# EAGLE design eTapper1main39 (EAGLE 8.4.1)
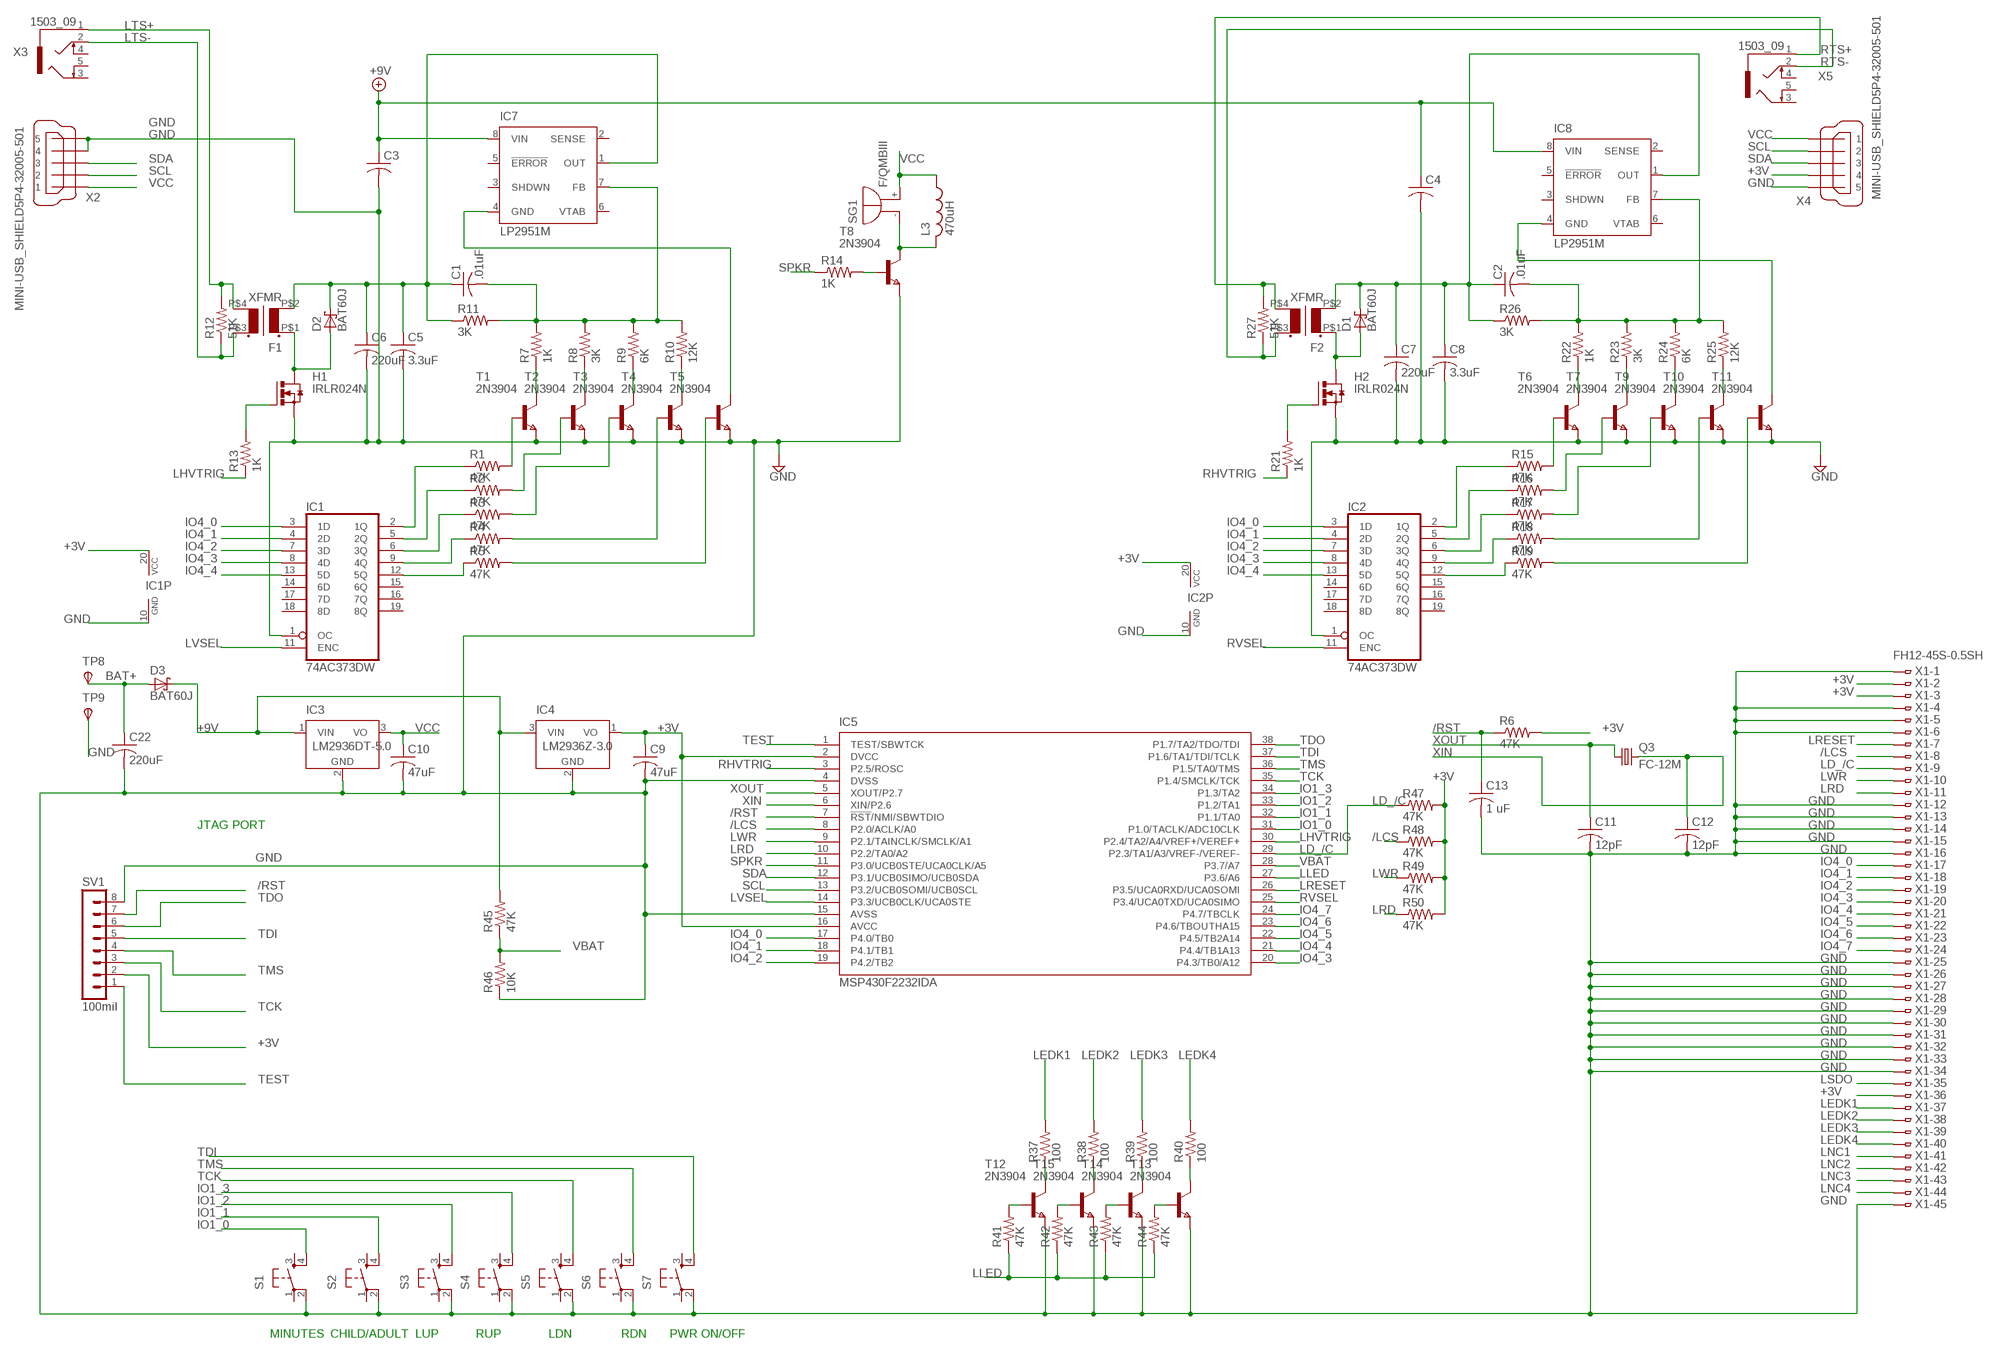
[diagram p0: schematic, sheet 1]

## Parts
C1  .01uF  C-USC0805  [C0805]
C2  .01uF  C-USC0805  [C0805]
C3  C-USC1206  [C1206]
C4  C-USC1206  [C1206]
C5  3.3uF  C-USC0805  [C0805]
C6  220uF  C-USC1206  [C1206]
C7  220uF  C-USC1206  [C1206]
C8  3.3uF  C-USC0805  [C0805]
C9  47uF  C-USC1206  [C1206]
C10  47uF  C-USC1206  [C1206]
C11  12pF  C-USC0805  [C0805]
C12  12pF  C-USC0805  [C0805]
C13  1 uF  C-USC0805  [C0805]
C22  220uF  C-USC1206  [C1206]
D1  BAT60J  [SOD323_ST]
D2  BAT60J  [SOD323_ST]
D3  BAT60J  [SOD323_ST]
F1  XFMR  [XFMR]
F2  XFMR  [XFMR]
H1  IRLR024N  [D-PAK_TO252AA]
H2  IRLR024N  [D-PAK_TO252AA]
IC1  74AC373DW  [SO20W]
IC2  74AC373DW  [SO20W]
IC3  LM2936DT-5.0  [TO252]
IC4  LM2936Z-3.0  [TO92]
IC5  MSP430F2232IDA  [TSSOP38_R-PDSO-G38-DA]
IC7  LP2951M  [SO08]
IC8  LP2951M  [SO08]
L3  470uH  L-USL2825P  [L2825P]
Q3  FC-12M  [FC-12M]
R1  47K  R-US_R0402  [R0402]
R2  47K  R-US_R0402  [R0402]
R3  47K  R-US_R0402  [R0402]
R4  47K  R-US_R0402  [R0402]
R5  47K  R-US_R0402  [R0402]
R6  47K  R-US_R0402  [R0402]
R7  1K  R-US_R0402  [R0402]
R8  3K  R-US_R0402  [R0402]
R9  6K  R-US_R0402  [R0402]
R10  12K  R-US_R0402  [R0402]
R11  3K  R-US_R0402  [R0402]
R12  51K  R-US_R0402  [R0402]
R13  1K  R-US_R0402  [R0402]
R14  1K  R-US_R0402  [R0402]
R15  47K  R-US_R0402  [R0402]
R16  47K  R-US_R0402  [R0402]
R17  47K  R-US_R0402  [R0402]
R18  47K  R-US_R0402  [R0402]
R19  47K  R-US_R0402  [R0402]
R21  1K  R-US_R0402  [R0402]
R22  1K  R-US_R0402  [R0402]
R23  3K  R-US_R0402  [R0402]
R24  6K  R-US_R0402  [R0402]
R25  12K  R-US_R0402  [R0402]
R26  3K  R-US_R0402  [R0402]
R27  51K  R-US_R0402  [R0402]
R37  100  R-US_R0402  [R0402]
R38  100  R-US_R0402  [R0402]
R39  100  R-US_R0402  [R0402]
R40  100  R-US_R0402  [R0402]
R41  47K  R-US_R0402  [R0402]
R42  47K  R-US_R0402  [R0402]
R43  47K  R-US_R0402  [R0402]
R44  47K  R-US_R0402  [R0402]
R45  47K  R-US_R0402  [R0402]
R46  10K  R-US_R0402  [R0402]
R47  47K  R-US_R0402  [R0402]
R48  47K  R-US_R0402  [R0402]
R49  47K  R-US_R0402  [R0402]
R50  47K  R-US_R0402  [R0402]
S1  10-XX  [B3F-10XX]
S2  10-XX  [B3F-10XX]
S3  10-XX  [B3F-10XX]
S4  10-XX  [B3F-10XX]
S5  10-XX  [B3F-10XX]
S6  10-XX  [B3F-10XX]
S7  10-XX  [B3F-10XX]
SG1  F/QMBIII  [F/QMBIII]
SV1  100mil  MA08-1  [MA08-1]
T1  2N3904  NPNSOT23  [SOT-23]
T2  2N3904  NPNSOT23  [SOT-23]
T3  2N3904  NPNSOT23  [SOT-23]
T4  2N3904  NPNSOT23  [SOT-23]
T5  2N3904  NPNSOT23  [SOT-23]
T6  2N3904  NPNSOT23  [SOT-23]
T7  2N3904  NPNSOT23  [SOT-23]
T8  2N3904  NPNSOT23  [SOT-23]
T9  2N3904  NPNSOT23  [SOT-23]
T10  2N3904  NPNSOT23  [SOT-23]
T11  2N3904  NPNSOT23  [SOT-23]
T12  2N3904  NPNSOT23  [SOT-23]
T13  2N3904  NPNSOT23  [SOT-23]
T14  2N3904  NPNSOT23  [SOT-23]
T15  2N3904  NPNSOT23  [SOT-23]
TP8  TPSPAD1-13  [P1-13]
TP9  TPSPAD1-13  [P1-13]
X1  FH12-45S-0.5SH  [FH12-45S-0.5SH]
X2  MINI-USB_SHIELD5P4-32005-501  [32005-501]
X3  1503_09  [1503_09]
X4  MINI-USB_SHIELD5P4-32005-501  [32005-501]
X5  1503_09  [1503_09]

## Nets
+3V [+3V]: C9.1 IC1.20(VCC) IC2.20(VCC) IC4.1(VO) IC5.2(DVCC) IC5.16(AVCC) R6.2 R47.2 R48.2 R49.2 R50.2 SV1.2 X1.2 X1.3 X1.36 X4.4
+9V [+9V]: C3.1 C4.1 D3.C IC3.1(VIN) IC4.3(VIN) IC7.8(VIN) IC8.8(VIN) R45.2
/LCS: IC5.8(P2.0/ACLK/A0) R48.1 X1.8
/RST: C13.1 IC5.7(!RST!/NMI/SBWTDIO) R6.1 SV1.7
BAT+ [BAT+]: C22.1 D3.A TP8.TP(PP)
GND [GND]: C3.2 C4.2 C5.2 C6.2 C7.2 C8.2 C9.2 C10.2 C11.2 C12.2 C13.2 C22.2 H1.3(S) H2.3(S) IC1.1(OC) IC1.10(GND) IC2.1(OC) IC2.10(GND) IC3.2(GND) IC4.2(GND) IC5.4(DVSS) IC5.15(AVSS) R46.1 S1.2(P1) S2.2(P1) S3.2(P1) S4.2(P1) S5.2(P1) S6.2(P1) S7.2(P1) SV1.8 T1.2(E) T2.2(E) T3.2(E) T4.2(E) T5.2(E) T6.2(E) T7.2(E) T8.2(E) T9.2(E) T10.2(E) T11.2(E) T12.2(E) T13.2(E) T14.2(E) T15.2(E) TP9.TP(PP) X1.1 X1.4 X1.5 X1.6 X1.12 X1.13 X1.14 X1.15 X1.16 X1.25 X1.26 X1.27 X1.28 X1.29 X1.30 X1.31 X1.32 X1.33 X1.34 X1.45 X2.4 X2.5 X4.5
IO1_0: IC5.31(P1.0/TACLK/ADC10CLK) S1.4(S1)
IO1_1: IC5.32(P1.1/TA0) S2.4(S1)
IO1_2: IC5.33(P1.2/TA1) S3.4(S1)
IO1_3: IC5.34(P1.3/TA2) S4.4(S1)
IO4_0: IC1.3(1D) IC2.3(1D) IC5.17(P4.0/TB0) X1.17
IO4_1: IC1.4(2D) IC2.4(2D) IC5.18(P4.1/TB1) X1.18
IO4_2: IC1.7(3D) IC2.7(3D) IC5.19(P4.2/TB2) X1.19
IO4_3: IC1.8(4D) IC2.8(4D) IC5.20(P4.3/TB0/A12) X1.20
IO4_4: IC1.13(5D) IC2.13(5D) IC5.21(P4.4/TB1A13) X1.21
IO4_5: IC5.22(P4.5/TB2A14) X1.22
IO4_6: IC5.23(P4.6/TBOUTHA15) X1.23
IO4_7: IC5.24(P4.7/TBCLK) X1.24
LD_/C: IC5.29(P2.3/TA1/A3/VREF-/VEREF-) R47.1 X1.9
LEDK1: R37.2 X1.37
LEDK2: R38.2 X1.38
LEDK3: R39.2 X1.39
LEDK4: R40.2 X1.40
LHVTRIG: IC5.30(P2.4/TA2/A4/VREF+/VEREF+) R13.1
LLED: IC5.27(P3.6/A6) R41.1 R42.1 R43.1 R44.1
LNC1: X1.41
LNC2: X1.42
LNC3: X1.43
LNC4: X1.44
LRD: IC5.10(P2.2/TA0/A2) R50.1 X1.11
LRESET: IC5.26(P3.5/UCA0RXD/UCA0SOMI) X1.7
LSDO: X1.35
LTS+: F1.P$4(S2) R12.2 X3.1
LTS-: F1.P$3(S1) R12.1 X3.2
LVSEL: IC1.11(ENC) IC5.14(P3.3/UCB0CLK/UCA0STE)
LWR: IC5.9(P2.1/TAINCLK/SMCLK/A1) R49.1 X1.10
N$1: IC1.2(1Q) R1.1
N$2: IC1.5(2Q) R2.1
N$3: IC1.6(3Q) R3.1
N$4: IC1.9(4Q) R4.1
N$5: IC1.12(5Q) R5.1
N$6: L3.2 SG1.-(+) T8.1(C)
N$7: R4.2 T4.3(B)
N$8: R5.2 T5.3(B)
N$9: D2.A F1.P$1(P1) H1.4(D)
N$10: R7.1 T1.1(C)
N$11: R8.1 T2.1(C)
N$12: R9.1 T3.1(C)
N$13: R1.2 T1.3(B)
N$14: R2.2 T2.3(B)
N$15: R3.2 T3.3(B)
N$16: R10.1 T4.1(C)
N$17: C1.2 IC7.7(FB) R7.2 R8.2 R9.2 R10.2 R11.2
N$18: C1.1 C5.1 C6.1 D2.C F1.P$2(P2) IC7.1(OUT) R11.1
N$19: D1.A F2.P$1(P1) H2.4(D)
N$20: IC2.2(1Q) R15.1
N$21: H1.1(G) R13.2
N$22: R14.2 T8.3(B)
N$24: IC2.5(2Q) R16.1
N$25: IC2.6(3Q) R17.1
N$26: IC2.9(4Q) R18.1
N$27: IC2.12(5Q) R19.1
N$28: R44.2 T13.3(B)
N$29: R15.2 T6.3(B)
N$30: R16.2 T7.3(B)
N$31: R17.2 T9.3(B)
N$32: R18.2 T10.3(B)
N$33: R19.2 T11.3(B)
N$35: R22.1 T6.1(C)
N$36: R23.1 T7.1(C)
N$37: R24.1 T9.1(C)
N$38: R25.1 T10.1(C)
N$39: C2.2 IC8.7(FB) R22.2 R23.2 R24.2 R25.2 R26.2
N$40: C2.1 C7.1 C8.1 D1.C F2.P$2(P2) IC8.1(OUT) R26.1
N$41: R37.1 T12.1(C)
N$42: H2.1(G) R21.2
N$43: R38.1 T15.1(C)
N$44: R39.1 T14.1(C)
N$45: IC7.4(GND) T5.1(C)
N$46: R40.1 T13.1(C)
N$47: IC8.4(GND) T11.1(C)
N$48: R43.2 T14.3(B)
N$49: R41.2 T12.3(B)
N$50: R42.2 T15.3(B)
RHVTRIG: IC5.3(P2.5/ROSC) R21.1
RTS+: F2.P$4(S2) R27.2 X5.1
RTS-: F2.P$3(S1) R27.1 X5.2
RVSEL: IC2.11(ENC) IC5.25(P3.4/UCA0TXD/UCA0SIMO)
SCL: IC5.13(P3.2/UCB0SOMI/UCB0SCL) X2.2 X4.2
SDA: IC5.12(P3.1/UCB0SIMO/UCB0SDA) X2.3 X4.3
SPKR: IC5.11(P3.0/UCB0STE/UCA0CLK/A5) R14.1
TCK: IC5.35(P1.4/SMCLK/TCK) S5.4(S1) SV1.3
TDI: IC5.37(P1.6/TA1/TDI/TCLK) S7.4(S1) SV1.5
TDO: IC5.38(P1.7/TA2/TDO/TDI) SV1.6
TEST: IC5.1(TEST/SBWTCK) SV1.1
TMS: IC5.36(P1.5/TA0/TMS) S6.4(S1) SV1.4
VBAT: IC5.28(P3.7/A7) R45.1 R46.2
VCC [VCC]: C10.1 IC3.3(VO) L3.1 SG1.+(-) X2.1 X4.1
XIN: C12.1 IC5.6(XIN/P2.6) Q3.2
XOUT: C11.1 IC5.5(XOUT/P2.7) Q3.1
Unconnected: IC1.14(6D) IC1.15(6Q) IC1.16(7Q) IC1.17(7D) IC1.18(8D) IC1.19(8Q) IC2.14(6D) IC2.15(6Q) IC2.16(7Q) IC2.17(7D) IC2.18(8D) IC2.19(8Q) IC7.2(SENSE) IC7.3(SHDWN) IC7.5(!ERROR) IC7.6(VTAB) IC8.2(SENSE) IC8.3(SHDWN) IC8.5(!ERROR) IC8.6(VTAB) S1.1(P) S1.3(S) S2.1(P) S2.3(S) S3.1(P) S3.3(S) S4.1(P) S4.3(S) S5.1(P) S5.3(S) S6.1(P) S6.3(S) S7.1(P) S7.3(S) X2.M1(S1) X2.M2(S2) X2.M3(S3) X2.M4(S4) X3.3 X3.4 X3.5 X4.M1(S1) X4.M2(S2) X4.M3(S3) X4.M4(S4) X5.3 X5.4 X5.5

## Notes on the sheet
- JTAG PORT
- MINUTES | CHILD/ADULT | LUP | RUP | LDN | RDN | PWR ON/OFF

## Library data of the parts
C1-C13 C22 = rcl:C-US: CAPACITOR, American symbol
D1-D3 = diode:BAT60J: Schottky barrier diode Source: www.st.com, BAT60J.pdf
F1 F2 = XFMR1:XFMR: Transformer 1"X1" 0.4"X0.4" hole separation for e_tapper
H1 H2 = IRLR024N:IRLR024N: IRLR024N HEXFET Power Mosfet N channel Infeneon Technology TO-251AA IPAK
IC1 IC2 = 74xx-eu:74*373: Octal D type transparent LATCH, edge triggered
IC3 = national-semiconductor:LM2936?*: Ultra-Low Quiescent Current LDO Voltage Regulator Source: Data sheet <http://www.national.com/ds/LM/LM2936.pdf>; MF: NATIONAL SEMICONDUCTOR; MPN: LM2936DT-5.0/NOPB; OC_FARNELL: 1286864; OC_NEWARK: 41K4501
IC4 = national-semiconductor:LM2936?*: Ultra-Low Quiescent Current LDO Voltage Regulator Source: Data sheet <http://www.national.com/ds/LM/LM2936.pdf>; MF: NATIONAL SEMICONDUCTOR; MPN: LM2936Z-3.0/NOPB; OC_FARNELL: 1312709; OC_NEWARK: 41K4531
IC5 = texas:MSP430F22*2IDA: MIXED SIGNAL MICROCONTROLLER Source: http://focus.ti.com/lit/ds/symlink/msp430f2274.pdf; MPN: MSP430F2232IDA; OC_FARNELL: 1610178; OC_NEWARK: 28M6312
IC7 IC8 = national-semiconductor:LP2951: Adjustable Micropower Voltage Regulator Source: http://www.national.com/ds/LP/LP2950.pdf; MF: FAIRCHILD SEMICONDUCTOR; MPN: LP2951CM; OC_FARNELL: 9488561; OC_NEWARK: 78K6014
L3 = rcl:L-US: INDUCTOR, American symbol
Q3 = crystal:FC-12M: kHz RANGE CRYSTAL UNIT LOW PROFILE SMD Source: Epson Toyocom FC-12M.pdf
R1-R19 R21-R27 R37-R50 = resistor:R-US_: RESISTOR, American symbol
S1-S7 = switch-omron:10-XX: OMRON SWITCH; MPN: B3F-1000; OC_FARNELL: 176432; OC_NEWARK: 36M3542
SG1 = buzzer:F/QMBIII: BUZZER Source: Buerklin; OC_FARNELL: unknown; OC_NEWARK: unknown
SV1 = con-lstb:MA08-1: PIN HEADER; OC_FARNELL: unknown; OC_NEWARK: unknown
T1-T15 = zetex:NPNSOT23: NPN TRANSISTOR; MPN: DSS20201L-7; OC_FARNELL: 1710688; OC_NEWARK: 25R4555
TP8 TP9 = testpad:TPS: TEST PIN
X1 = con-hirose:FH12-45S-0.5S: 0.5mm Pitch Connectors For FPC/FFC Source: Data sheet <http://www.hirose.co.jp/cataloge_hp/e58605370.pdf>; OC_FARNELL: unknown; OC_NEWARK: unknown
X2 X4 = con-cypressindustries:MINI-USB_SHIELD5P4-: MINI USB-B R/A W/O POST 5 pol. Source: www.cypressindustries.com; OC_FARNELL: unknown; OC_NEWARK: unknown
X3 X5 = con-lumberg:1503_09: Jack connectors according to JISC 6560, 3.5 mm Klinkeneinbaukupplung nach JISC 6560, 3,5 mm, 3-polig/ stereo, abgewinkelte Ausführung, mit 2 Öffnern und Lötaugen, für Leiterplatten Rückseitenmontage Source: http://www.lumberg.com/Produkte/PDFs/1503_09.pdf; OC_FARNELL: 1243244; OC_NEWARK: unknown

## Module LP2951
Ports: 

### Library data of the parts

## Net classes
1 GND: width 0.305 mm, clearance 0.152 mm
2 BAT+: width 0.305 mm, clearance 0.152 mm
3 +9V: width 0.305 mm, clearance 0.152 mm
4 +3V: width 0.305 mm, clearance 0.152 mm
5 VCC: width 0.305 mm, clearance 0.152 mm

## Board
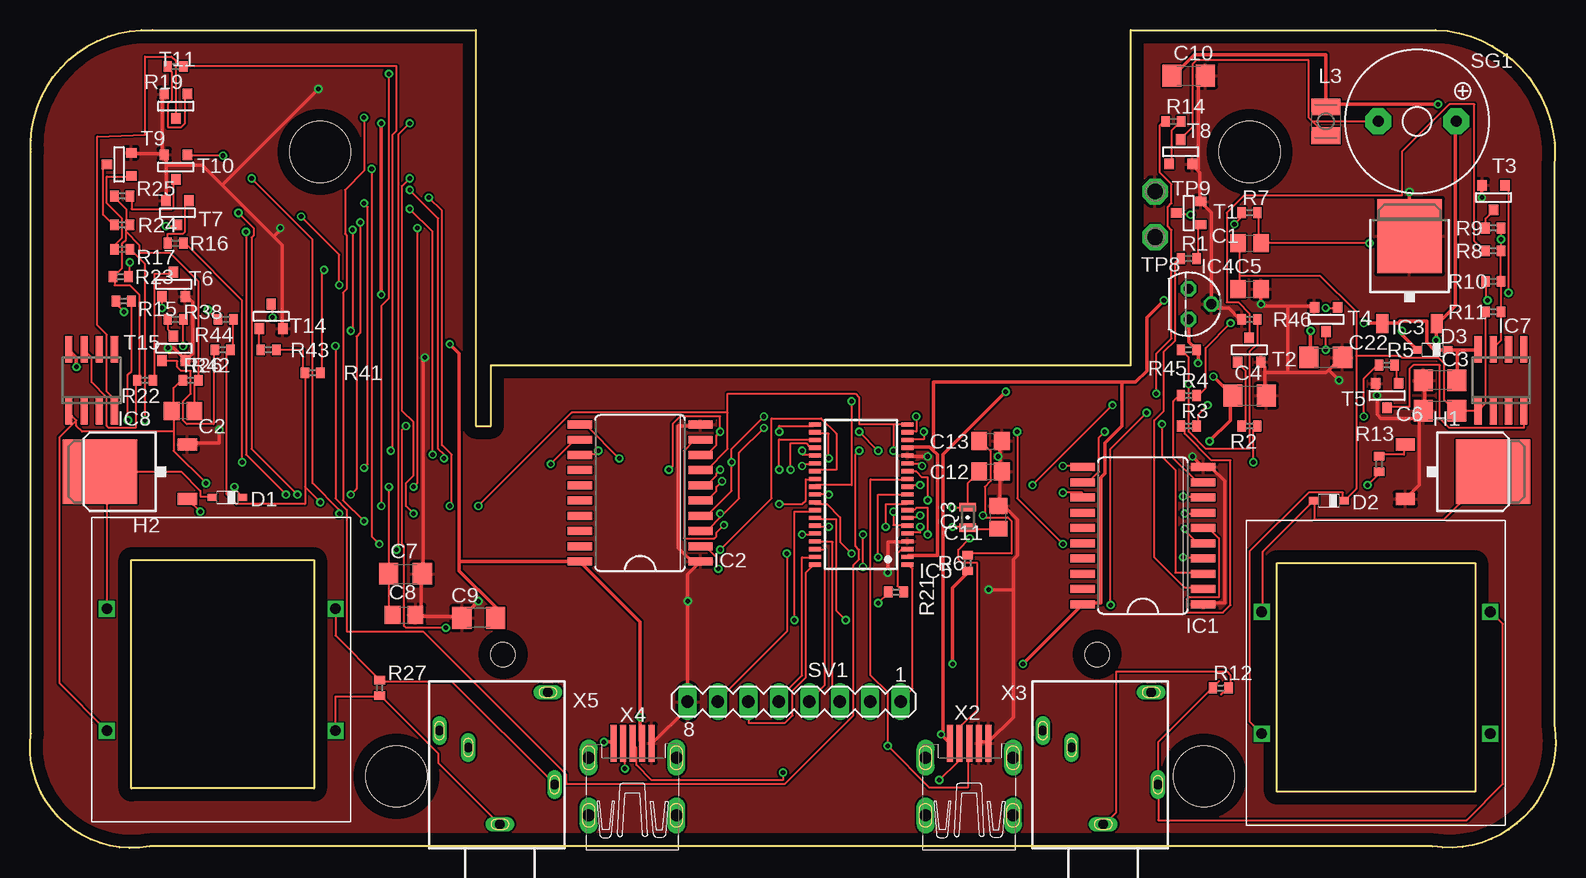
[diagram p1: board, top side]
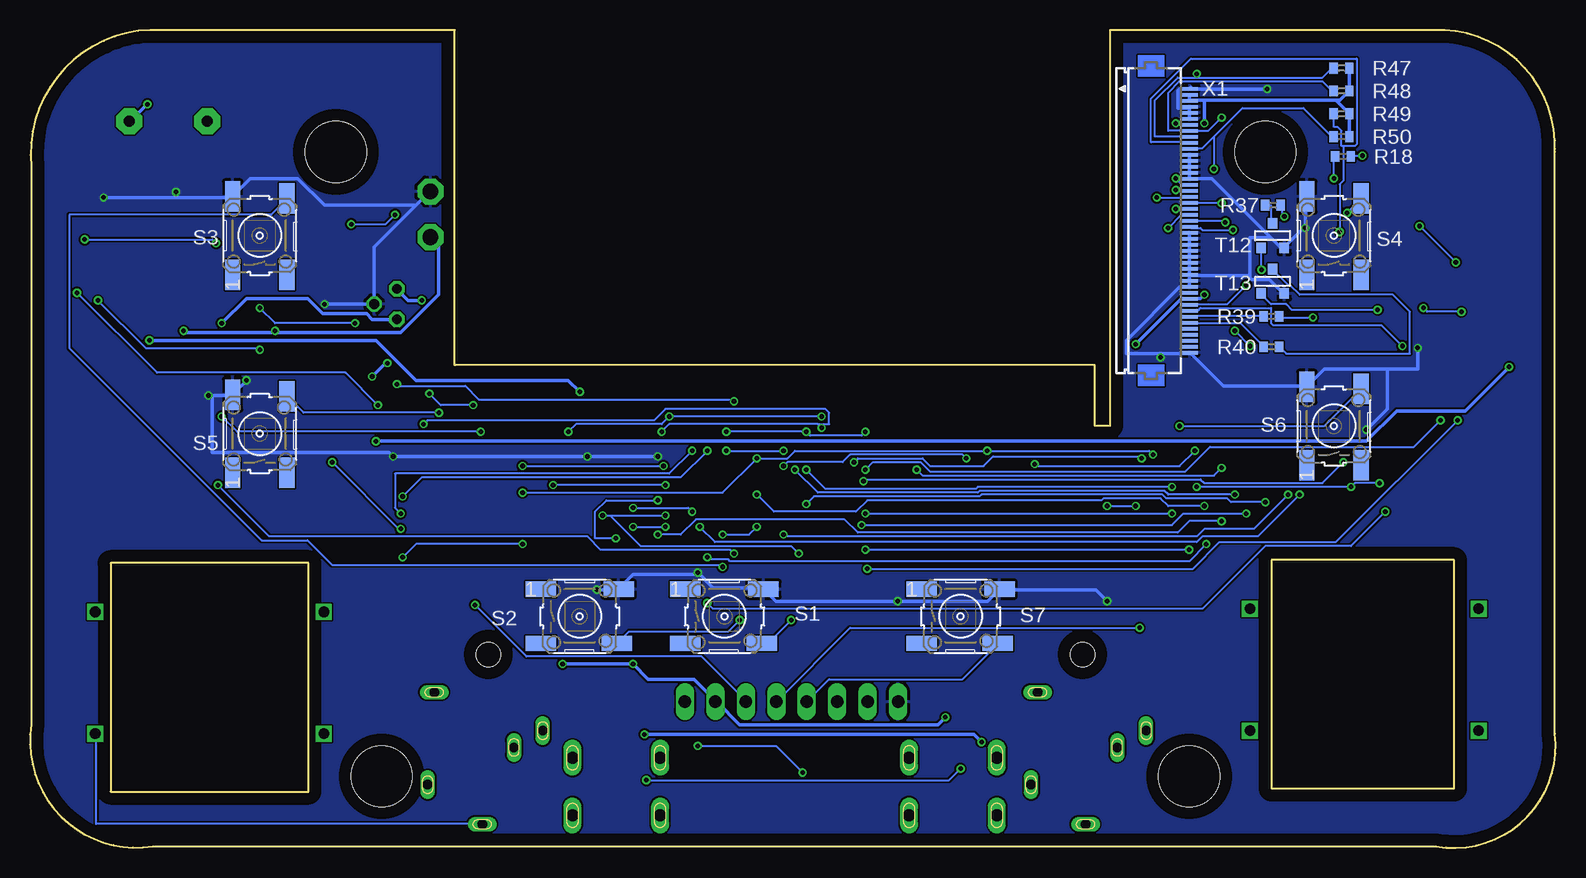
[diagram p2: board, bottom side, seen from below]

Size 127.17 x 68.21 mm. Coordinates in mm from the lower left corner, seen from the top.
Outline: 0.06,58.04 0.06,58.3 0.06,9.53
Outline: 0.06,58.04 0.06,9.53
Outline: 0.06,58.04 arc-96 10.22,68.2 37.15,68.2 37.15,35.18 38.42,35.18 38.42,40.26 91.76,40.26 91.76,68.2 117.16,68.2 arc-94 127.06,56.77 127.06,10.29 arc-108 116.9,0.13 9.97,0.13 arc-107 0.06,9.53
Outline: 103.95,23.75 120.46,23.75 120.46,4.7 103.95,4.7 103.95,23.75
Outline: 8.45,24.01 23.69,24.01 23.69,4.96 8.45,4.96 8.45,24.01
Copper layers (1*16): Top 0.035mm / dielectric 30mil / Bottom 0.035mm
Design rules "default *": minimum track width 6mil, minimum drill 15mil, track to track 6mil, track to pad 6mil, pad to pad 6mil, via to via 6mil, smd to smd 6mil, copper to edge 40mil, drill to drill 6mil, minimum pad ring 6mil, minimum via ring 6mil, stop-mask expansion 4mil, vias tented up to drill 0mil, thermal gap 10mil
Holes 5.08 mm at 24.19,58.04 101.66,58.04 30.54,5.97 97.85,5.97
Holes 2.03 mm at 39.43,16.13 88.96,16.13

### Footprints (pad centres in the part's own frame; a part is rotated, then mirrored left to right if it is on the bottom)
C0805 = smd 1.3 x 1.5: 1 -0.95,0; 2 0.95,0
C1206 = smd 1.6 x 1.8: 1 -1.4,0; 2 1.4,0
SOD323_ST = smd 0.8 x 0.6: A 1.25,0; C -1.25,0
XFMR = drill 0.889 square: P$1 -10.16,5.08; P$2 -10.16,-5.08; P$3 8.89,5.08; P$4 8.89,-5.08
D-PAK_TO252AA = smd 1 x 1.6: 1 -2.28,-4.8; 3 2.28,-4.8 | smd 5.4 x 6.2: 4 0,2.5
SO20W = smd 0.66 x 2.032: 1 -5.715,-5.029; 2 -4.445,-5.029; 3 -3.175,-5.029; 4 -1.905,-5.029; 5 -0.635,-5.029; 6 0.635,-5.029; 7 1.905,-5.029; 8 3.175,-5.029; 9 4.445,-5.029; 10 5.715,-5.029; 11 5.715,5.029; 12 4.445,5.029; 13 3.175,5.029; 14 1.905,5.029; 15 0.635,5.029; 16 -0.635,5.029; 17 -1.905,5.029; 18 -3.175,5.029; 19 -4.445,5.029; 20 -5.715,5.029
TO252 = smd 1 x 1.6: 1 -2.28,-4.8; 3 2.28,-4.8 | smd 5.4 x 6.2: 2 0,2.5
TO92 = drill 0.813 pad 1.27 octagon: 1 -1.27,0; 2 0,1.905; 3 1.27,0
TSSOP38_R-PDSO-G38-DA = smd 0.35 x 1: 1 -5.85,-3.85; 2 -5.2,-3.85; 3 -4.55,-3.85; 4 -3.9,-3.85; 5 -3.25,-3.85; 6 -2.6,-3.85; 7 -1.95,-3.85; 8 -1.3,-3.85; 9 -0.65,-3.85; 10 0,-3.85; 11 0.65,-3.85; 12 1.3,-3.85; 13 1.95,-3.85; 14 2.6,-3.85; 15 3.25,-3.85; 16 3.9,-3.85; 17 4.55,-3.85; 18 5.2,-3.85; 19 5.85,-3.85; 20 5.85,3.85; 21 5.2,3.85; 22 4.55,3.85; 23 3.9,3.85; 24 3.25,3.85; 25 2.6,3.85; 26 1.95,3.85; 27 1.3,3.85; 28 0.65,3.85; 29 0,3.85; 30 -0.65,3.85; 31 -1.3,3.85; 32 -1.95,3.85; 33 -2.6,3.85; 34 -3.25,3.85; 35 -3.9,3.85; 36 -4.55,3.85; 37 -5.2,3.85; 38 -5.85,3.85
SO08 = smd 0.6 x 2.2: 1 -1.905,-2.6; 2 -0.635,-2.6; 3 0.635,-2.6; 4 1.905,-2.6; 5 1.905,2.6; 6 0.635,2.6; 7 -0.635,2.6; 8 -1.905,2.6
L2825P = smd 1.4 x 2.4: 1 -1.2,0; 2 1.2,0
FC-12M = smd 0.7 x 1.4: 1 -0.85,0; 2 0.85,0
R0402 = smd 0.7 x 0.9: 1 -0.65,0; 2 0.65,0
B3F-10XX = smd 2.54 x 1.27: 1 -3.251,2.261; 2 3.251,2.261; 3 -3.251,-2.261; 4 3.099,-2.261
F/QMBIII = drill 0.914 pad 2.159 octagon: + 3.251,0; - -3.251,0
MA08-1 = drill 1.016 long: 1 -8.89,0; 2 -6.35,0; 3 -3.81,0; 4 -1.27,0; 5 1.27,0; 6 3.81,0; 7 6.35,0; 8 8.89,0
SOT-23 = smd 0.787 x 0.889: 1 0.025,-1.016; 2 -0.94,1.016; 3 0.991,1.016
P1-13 = drill 1.321 pad 2.159 octagon: TP 0,0
FH12-45S-0.5SH = smd 0.3 x 1.3: 1 -13,3.25; 2 -12.5,3.25; 3 -12,3.25; 4 -11.5,3.25; 5 -11,3.25; 6 -10.5,3.25; 7 -10,3.25; 8 -9.5,3.25; 9 -9,3.25; 10 -8.5,3.25; 11 -8,3.25; 12 -7.5,3.25; 13 -7,3.25; 14 -6.5,3.25; 15 -6,3.25; 16 -5.5,3.25; 17 -5,3.25; 18 -4.5,3.25; 19 -4,3.25; 20 -3.5,3.25; 21 -3,3.25; 22 -2.5,3.25; 23 -2,3.25; 24 -1.5,3.25; 25 -1,3.25; 26 -0.5,3.25; 27 0,3.25; 28 0.5,3.25; 29 1,3.25; 30 1.5,3.25; 31 2,3.25; 32 2.5,3.25; 33 3,3.25; 34 3.5,3.25; 35 4,3.25; 36 4.5,3.25; 37 5,3.25; 38 5.5,3.25; 39 6,3.25; 40 6.5,3.25; 41 7,3.25; 42 7.5,3.25; 43 8,3.25; 44 8.5,3.25; 45 9,3.25
32005-501 = smd 3.1 x 0.5: 1 3,1.6; 2 3,0.8; 3 3,0; 4 3,-0.8; 5 3,-1.6 | drill 1 pad 1.422 long: M1 -3,3.65; M2 -3,-3.65; M3 1.8,3.65; M4 1.8,-3.65
1503_09 = drill 0.8 pad 1.2 long: 1 0,-2.1; 2 -4.55,-5.4; 3 5.05,-9.9; 4 -4,-13.1; 5 2.65,-8.5

### Placement (x,y rotation side)
C1  101.66,50.42 0 top
C2  12.76,36.45 0 top
C3  117.54,38.99 180 top
C4  101.66,37.72 0 top
C5  101.66,46.61 0 top
C6  117.54,36.45 180 top
C7  31.31,22.87 0 top
C8  31.18,19.44 0 top
C9  37.4,19.18 180 top
C10  96.58,64.39 0 top
C11  80.71,27.56 90 top
C12  80.07,31.37 0 top
C13  80.07,33.91 0 top
C22  108.01,40.9 0 top
D1  16.45,29.22 180 top
D2  108.27,28.96 180 top
D3  116.9,41.53 180 top
F1  112.84,14.61 0 top
F2  16.57,14.86 0 top
H1  119.44,31.37 270 top
H2  8.32,31.37 90 top
IC1  92.77,26.04 90 top
IC2  50.86,29.6 90 top
IC3  115,48.52 0 top
IC4  96.58,45.34 270 top
IC5  69.28,29.47 90 top
IC7  122.62,38.99 0 top
IC8  5.14,38.99 0 top
L3  108.01,60.58 270 top
Q3  78.17,27.56 90 top
R1  96.58,49.15 0 top
R2  101.66,35.18 180 top
R3  96.58,35.18 0 top
R4  96.58,37.72 0 top
R5  113.09,40.26 0 top
R6  78.17,23.75 270 top
R7  101.66,52.96 0 top
R8  121.98,49.79 0 top
R9  121.98,51.69 0 top
R10  121.98,47.25 0 top
R11  121.98,44.71 0 top
R12  99.25,13.34 0 top
R13  112.46,32.01 90 top
R14  95.31,60.58 0 top
R15  7.81,45.6 180 top
R16  12.13,50.42 180 top
R17  7.68,49.92 180 top
R18  17.72,57.66 0 bottom
R19  12.13,65.16 180 top
R21  72.2,21.34 180 top
R22  9.59,38.99 180 top
R23  7.56,47.63 180 top
R24  7.68,51.95 0 top
R25  7.68,54.36 180 top
R26  13.4,38.99 0 top
R27  29.15,13.34 270 top
R37  23.56,53.6 0 bottom
R38  12.13,44.07 0 top
R39  23.69,44.33 180 bottom
R40  23.69,41.79 180 bottom
R41  23.56,39.63 0 top
R42  16.07,41.53 180 top
R43  19.88,41.53 180 top
R44  16.32,44.07 180 top
R45  96.58,41.53 0 top
R46  101.66,44.07 0 top
R47  17.84,65.03 0 bottom
R48  17.84,63.12 0 bottom
R49  17.84,61.22 0 bottom
R50  17.84,59.31 0 bottom
S1  69.28,19.31 0 bottom
S2  81.34,19.31 0 bottom
S3  108.01,51.06 90 bottom
S4  18.48,51.06 90 bottom
S5  108.01,34.55 90 bottom
S6  18.48,35.18 90 bottom
S7  49.59,19.31 0 bottom
SG1  115.63,60.58 0 top
SV1  63.69,12.2 180 top
T1  96.58,52.96 270 top
T2  101.66,41.53 180 top
T3  121.98,54.23 0 top
T4  108.01,44.07 0 top
T5  113.09,37.72 0 top
T6  12,47 180 top
T7  12.26,52.96 0 top
T8  95.95,58.04 180 top
T9  7.43,57.03 270 top
T10  12.13,56.77 0 top
T11  12.13,61.85 0 top
T12  23.56,51.06 180 bottom
T13  23.56,47.25 180 bottom
T14  20.13,44.33 180 top
T15  12,41.66 180 top
TP8  93.79,50.93 0 top
TP9  93.79,54.74 0 top
X1  33.72,50.3 270 bottom
X2  78.3,5.72 90 top
X3  89.47,-0.12 180 top
X4  50.23,5.72 90 top
X5  39.18,-0.12 180 top

### Tracks (layer width: path | path; a pad name or v marks a point on that pad's centre or on a via)
+3V  (via drill 0.38)
  Top 0.305: v76.9,15.34 76.9,21.69 78.17,22.96 R6.2 | v82.77,15.34 87.69,20.26 IC1.20 87.85,20.42 89.28,20.42 89.28,30.9 89.6,31.22 89.6,33.76 91.03,35.18 91.03,38.84 | 75.23,33.2 74.99,33.44 73.25,33.44 IC5.16 | 75.23,33.2 75.63,32.8 75.63,24.39 73.25,24.39 IC5.2 | v94.52,45.66 93.09,44.23 93.09,39.79 92.14,38.84 91.03,38.84 | 91.03,38.84 75.31,38.84 75.31,33.28 75.23,33.2 | v34.99,42.01 35.78,41.22 35.78,23.91 | 35.78,23.91 35.78,23.12 38.8,20.1 38.8,19.31 C9.1 | 35.78,23.91 45.78,23.91 IC2.20 45.94,23.75 50.86,18.83 v50.86,10.9 50.86,8.99 51.02,8.83 X4.4 | v29.27,46.14 v29.27,60.43
  Bottom 0.305: v82.77,15.34 v76.9,15.34 75.63,14.07 71.82,14.07 70.07,12.32 SV1.2 69.91,12.17 68.01,10.26 51.5,10.26 v50.86,10.9 | IC4.1 95.63,45.66 v94.52,45.66 | 17.21,61.22 17.21,59.31 R50.2 | X1.2 30.54,62.65 30.54,62.33 X1.3 30.38,62.33 29.27,62.33 | 17.21,63.12 17.21,65.03 R47.2 | 18.32,62.33 18,62.33 17.21,63.12 | 18.32,62.33 29.27,62.33 | 17.21,63.12 R48.2 | 18.32,62.33 17.21,61.22 | 17.21,61.22 R49.2 | v34.99,42.01 31.18,45.82 30.54,45.82 X1.36 30.38,45.82 29.59,45.82 v29.27,46.14 | v29.27,60.43 29.27,62.33
+9V  (via drill 0.38)
  Top 0.305: 118.97,41.53 120.71,41.53 IC7.8 | 118.97,41.53 D3.C 117.06,41.53 116.43,42.17 116.43,43.92 114.2,43.92 114.05,43.76 112.78,43.76 IC3.1 112.62,43.76 v111.19,43.76 | 118.97,41.53 118.97,38.99 C3.1 | IC4.3 96.58,42.17 97.22,41.53 R45.2 97.38,41.53 v97.38,40.42 | v98.65,39.31 100.23,37.72 C4.1 100.08,37.72 100.08,35.66 v98.33,33.91 | v3.87,40.11 3.87,40.9 3.24,41.53 IC8.8
  Bottom 0.305: v98.65,39.31 97.54,40.42 v97.38,40.42 | v3.87,40.11 7.52,36.45 13.24,36.45 15.78,33.91 v98.33,33.91 | v111.19,43.76 109.12,45.82 104.04,45.82 102.77,44.55 99.12,44.55 98.65,44.07 IC4.3
/LCS  (via drill 0.38)
  Top 0.152: v74.83,26.14 74.83,28.36 73.88,28.36 73.72,28.2 73.25,28.2 IC5.8 | v27.84,27.25 26.1,28.99 26.1,46.3 26.42,46.61 26.42,51.06 26.26,51.22 26.26,54.87 27.84,56.46 v27.84,60.9
  Bottom 0.152: R48.1 18.64,63.12 19.43,63.92 31.34,63.92 32.29,62.97 32.29,59.79 30.54,59.79 X1.8 30.38,59.79 28.96,59.79 v27.84,60.9 | v74.83,26.14 72.93,26.14 71.66,27.41 59.28,27.41 58.17,26.29 31.5,26.29 30.54,27.25 v27.84,27.25
/RST  (via drill 0.38)
  Top 0.152: 79.6,27.72 79.6,30.1 80.07,30.58 80.07,33.12 79.28,33.91 C13.1 | 79.6,27.72 79.6,27.56 81.5,27.56 81.82,27.25 81.82,24.55 78.17,24.55 R6.1 | v74.2,27.72 74.2,27.56 73.25,27.56 IC5.7 | 79.6,27.72 v79.44,27.72 | v63.09,24.55 63.09,18.04 57.37,12.32 SV1.7
  Bottom 0.152: v79.44,27.72 78.8,27.72 | 78.8,27.72 v74.2,27.72 | v63.09,24.55 63.72,25.18 76.26,25.18 78.8,27.72
BAT+  (via drill 0.38)
  Top 0.305: v114.36,43.12 114.36,42.8 115.63,41.53 D3.A | v106.74,43.12 106.74,40.9 C22.1
  Bottom 0.305: v114.36,43.12 114.2,42.96 106.74,42.96 | 106.74,42.96 96.27,42.96 93.09,46.14 93.09,50.9 93.73,50.9 TP8.TP | 106.74,42.96 v106.74,43.12
GND  (via drill 0.38)
  Top 0.305: v121.03,54.23 121.03,55.19 T3.2 | R46.1 100.87,44.07 99.92,45.03 98.49,45.03 IC4.2 98.49,52.96 97.69,53.76 T1.2 97.54,53.92 97.54,56.3 97.3,56.54 | 97.3,56.54 96.9,56.93 T8.2 | C10.2 97.85,64.39 97.38,63.92 97.38,56.62 97.3,56.54 | v115,54.71 IC3.2 | 104.84,45.19 102.62,45.19 v102.62,45.34 C5.2 | 104.84,45.19 107.06,45.19 T4.2 | 102.93,39.63 102.93,37.72 C4.2 | 102.93,39.63 102.93,40.11 102.62,40.42 T2.2 | 108.25,39.87 108.01,39.63 104.84,39.63 | 108.25,39.87 109.28,40.9 C22.2 | 102.93,39.63 104.84,39.63 | 104.84,39.63 104.84,45.19 | 115.79,35.82 116.11,35.82 116.11,36.45 C6.2 | 115.79,35.82 112.62,35.82 112.3,36.14 v112.3,37.72 112.3,38.68 T5.2 | 115.79,35.82 115.79,30.26 114.68,29.15 H1.3 | 115.79,35.82 C6.2 | C3.2 116.27,38.99 116.27,36.45 C6.2 | v109.12,38.99 108.25,39.87 | IC1.1 97.85,20.42 99.6,20.42 99.6,30.58 98.49,31.69 97.85,31.69 IC1.10 97.69,31.85 v96.9,32.64 | X2.4 79.12,8.83 79.76,8.83 X2.5 79.91,8.83 81.98,10.9 81.98,21.53 | 80.87,31.37 80.87,28.83 | 80.87,28.83 80.87,28.68 C11.2 80.87,28.83 | v74.83,32.64 73.25,32.64 IC5.15 | C13.2 80.87,33.91 80.87,32.8 v80.71,32.64 80.87,32.64 80.87,31.37 | 80.87,31.37 C12.2 | 81.98,21.53 81.98,24.07 82.3,24.39 82.3,27.41 80.87,28.83 | 16.02,55.27 14.35,56.93 11.33,56.93 | 16.02,55.27 20.3,50.98 | 20.3,50.98 21.02,50.27 21.02,43.44 T14.2 | 11.33,56.93 11.33,57.73 T10.2 | 11.02,57.89 11.18,57.89 T10.2 | 11.02,57.89 8.48,57.89 T9.2 | 11.02,57.89 11.02,62.65 11.18,62.81 T11.2 | 11.02,57.89 T10.2 | 11.33,56.93 11.33,54.08 T7.2 | 16.02,55.27 v24.03,63.28 | T6.2 13.08,45.98 13.56,45.5 13.56,41.22 13.08,40.74 T15.2 12.92,40.74 11.97,41.69 v11.49,41.69
  Top 0.305: v15.78,34.87 15.78,33.76 13.24,33.76 H2.3 | 20.3,50.98 20.86,51.54 v20.86,51.69 | IC2.10 55.78,35.18 54.04,35.18 54.04,25.02 55.47,23.6 IC2.1 55.78,23.75 54.83,22.8 v54.83,20.58 54.83,12.32 SV1.8 54.67,12.17 54.67,11.53 51.97,8.83 X4.5 | v71.5,22.96 71.5,25.5 73.09,25.5 IC5.4 | v37.37,20.58 36.1,19.31 C9.2 35.94,19.31 32.13,19.31 C8.2 32.13,19.47 32.61,19.94 32.61,22.8 C7.2 32.77,22.96 32.77,40.74 v32.92,40.9 | v79.91,21.53 81.98,21.53
  Bottom 0.305: 115,54.23 110.39,54.23 S3.2 110.24,54.39 108.81,55.82 104.84,55.82 102.62,53.6 95.15,53.6 95.08,53.52 | 115,54.23 v121.03,54.23 | 95.08,53.52 98.49,50.11 IC4.2 v102.62,45.34 | 95.08,53.52 93.88,54.71 TP9.TP | 115,54.23 v115,54.71 | 111.98,37.72 110.39,37.72 S5.2 110.24,37.88 v109.12,38.99 | v74.83,32.64 v80.71,32.64 v96.9,32.64 97.22,32.96 111.98,32.96 111.98,37.72 | 111.98,37.72 v112.3,37.72 | X1.6 30.54,60.9 30.54,61.22 X1.5 30.54,61.38 30.54,61.7 | 30.54,61.7 31.5,61.7 31.5,63.12 31.34,63.28 30.54,63.28 X1.1 30.38,63.44 30.23,63.28 v24.03,63.28 | 30.54,61.7 X1.4 | 30.54,49.79 30.54,50.27 X1.27 30.54,50.42 30.54,50.74 X1.26 30.54,50.9 30.54,51.22 X1.25 | 25.54,47.65 25.62,47.73 30.38,47.73 X1.32 | 25.54,47.65 25.3,47.41 23.88,47.41 22.76,46.3 T13.2 | X1.32 30.54,47.73 30.54,47.41 X1.33 30.54,47.25 30.54,46.93 X1.34 30.54,46.77 31.34,46.77 35.78,42.33 35.78,41.22 32.92,41.22 | X1.32 30.54,47.88 30.54,48.2 X1.31 30.54,48.36 30.54,48.68 X1.30 30.54,48.84 30.54,49.15 X1.29 30.54,49.31 30.54,49.79 | 30.54,49.79 X1.28 | 30.54,56.3 30.54,55.82 X1.16 30.38,55.82 28.64,55.82 23.8,50.98 | X1.12 30.54,57.73 30.54,57.41 X1.13 30.54,57.25 30.54,56.93 X1.14 30.54,56.77 30.54,56.3 | 30.54,56.3 X1.15 | 20.94,51.77 20.86,51.85 20.86,54.23 S4.2 | 20.94,51.77 22.61,50.11 T12.2 22.76,50.11 22.92,50.11 23.8,50.98 | 25.54,47.65 25.46,47.73 25.46,50.9 23.88,50.9 23.8,50.98 | v15.78,34.87 14.03,36.61 14.03,39.95 | 14.03,39.95 19.27,39.95 20.7,38.52 S6.2 20.86,38.52 27.69,38.52 30.38,41.22 X1.45 30.54,41.22 32.92,41.22 | v11.49,41.69 11.49,39.95 14.03,39.95 | v20.86,51.69 20.94,51.77
  Bottom 0.305: v37.37,20.58 38.32,21.53 46.26,21.53 S7.2 46.42,21.53 47.37,20.58 v54.83,20.58 64.99,20.58 65.94,21.53 S1.2 66.1,21.69 70.23,21.69 v71.5,22.96 71.5,22.8 76.9,22.8 78.01,21.69 S2.2 78.17,21.53 v79.91,21.53 | v32.92,40.9 32.92,41.22
  pour Bottom: -2.48,69.22 128.08,69.22 128.08,-0.88 -2.48,-0.88
  pour Top: -0.95,68.97 128.08,68.97 128.08,-0.88 -2.48,-0.88 -2.48,68.97
IO1_0  (via drill 0.38)
  Top 0.152: v63.72,18.99 63.72,28.04 65.31,28.04 IC5.31
  Bottom 0.152: v63.72,18.99 65.63,17.09 66.1,17.09 S1.4
IO1_1  (via drill 0.38)
  Top 0.152: v68.01,18.99 67.21,19.79 67.21,27.41 65.47,27.41 IC5.32
  Bottom 0.152: v68.01,18.99 68.96,18.04 77.22,18.04 78.17,17.09 S2.4
IO1_2  (via drill 0.38)
  Top 0.152: v66.58,26.77 65.47,26.77 IC5.33 | v69.44,23.44 v69.44,26.14
  Bottom 0.152: v66.58,26.77 67.21,26.14 v69.44,26.14 | v69.44,23.44 69.6,23.6 101.98,23.6 104.04,25.66 107.85,25.66 123.89,41.69 123.89,52.81 107.06,52.81 105.79,54.08 S3.4
IO1_3  (via drill 0.38)
  Top 0.152: v64.36,26.14 65.31,26.14 IC5.34 | v22.29,29.47 18.48,33.28 18.48,50.9 18.64,51.06 18.64,51.69 v17.37,52.96
  Bottom 0.152: v64.36,26.14 64.2,25.98 29.91,25.98 29.27,26.61 25.15,26.61 v22.29,29.47 | v17.37,52.96 16.26,54.08 S4.4
IO4_0  (via drill 0.38)
  Top 0.152: v74.52,34.71 74.52,34.07 73.25,34.07 IC5.17 | v61.18,35.03 59.12,32.96 59.12,29.15 57.69,27.72 | 57.69,27.72 56.42,26.45 55.94,26.45 IC2.3 | v31.65,55.82 31.02,55.19 31.02,36.45 31.97,35.5 31.97,31.06 31.34,30.42 31.34,28.52 v31.97,27.88 | 57.69,27.72 v57.53,27.88 | v94.36,35.34 94.36,32.64 95.47,31.53 95.47,22.96 97.69,22.96 IC1.3
  Bottom 0.152: v74.52,34.71 73.88,35.34 61.5,35.34 | v61.18,35.03 61.5,35.34 | v31.65,55.82 31.18,55.35 30.54,55.35 X1.17 | v57.53,27.88 v31.97,27.88 | v94.36,35.34 94.04,35.66 75.15,35.66 74.2,36.61 60.86,36.61 60.55,36.3 60.55,35.34 61.5,35.34
IO4_1  (via drill 0.38)
  Top 0.152: v73.88,35.98 73.88,34.71 73.25,34.71 IC5.18 | v61.18,35.98 58.48,33.28 v58.48,32.17 58.48,29.79 56.42,27.72 55.94,27.72 IC2.4 | v31.65,54.87 34.04,52.49 34.04,33.28 34.51,32.8 v34.51,32.49 | v96.11,24.23 97.69,24.23 IC1.4 | v86.11,25.34 82.3,29.15 v82.3,34.71
  Bottom 0.152: v61.18,35.98 v73.88,35.98 74.52,35.34 81.66,35.34 v82.3,34.71 | v31.65,54.87 30.54,54.87 X1.18 | v34.51,32.49 34.67,32.64 46.89,32.64 47.69,31.85 52.13,31.85 52.77,32.49 58.17,32.49 v58.48,32.17 | v96.11,24.23 95,25.34 v86.11,25.34
IO4_2  (via drill 0.38)
  Top 0.152: 71.98,35.34 69.12,35.34 69.12,37.57 68.8,37.88 58.17,37.88 58.17,36.3 | 71.98,35.34 73.09,35.34 IC5.19 | 58.17,36.3 58.17,33.28 56.42,31.53 55.94,31.53 IC2.7 | v33.24,54.23 34.35,53.12 34.35,33.6 35.15,32.8 35.15,28.68 v34.99,28.52 | v37.37,28.52 45.15,36.3 58.17,36.3 | v96.27,27.88 97.69,27.88 IC1.7 | 71.98,35.34 v71.98,33.12
  Bottom 0.152: v33.24,54.23 30.54,54.23 X1.19 | v37.37,28.52 v34.99,28.52 | v96.27,27.88 96.74,28.36 96.74,31.22 73.88,31.22 v71.98,33.12
IO4_3  (via drill 0.38)
  Top 0.152: v62.45,34.71 62.45,35.18 65.31,35.18 IC5.20 | IC2.8 55.94,32.8 56.42,32.8 57.21,33.6 57.21,34.39 v57.53,34.71 57.53,35.98 54.2,35.98 53.56,35.34 53.56,31.85 v53.24,31.53 | v27.84,53.76 28.16,53.44 28.16,32.01 v27.84,31.69 | v96.11,29.31 97.69,29.31 IC1.8 | v69.12,34.71 v70.71,33.12
  Bottom 0.152: v57.53,34.71 57.85,34.39 62.13,34.39 v62.45,34.71 v69.12,34.71 | v27.84,53.76 30.38,53.76 X1.20 | v27.84,31.69 28.48,31.06 52.77,31.06 v53.24,31.53 | v96.11,29.31 94.52,30.9 72.93,30.9 v70.71,33.12
IO4_4  (via drill 0.38)
  Top 0.152: v66.58,32.49 66.58,34.55 65.47,34.55 IC5.21 | v86.11,29.63 87.69,29.63 87.69,29.31 IC1.13 | v31.65,53.28 33.56,51.38 v33.56,32.8 | v47.37,33.12 47.37,32.8 45.94,32.8 IC2.13
  Bottom 0.152: v86.11,29.63 69.44,29.63 v66.58,32.49 64.04,32.49 63.4,33.12 v47.37,33.12 33.88,33.12 v33.56,32.8 | v31.65,53.28 30.54,53.28 X1.21
IO4_5  (via drill 0.38)
  Top 0.152: v62.45,31.53 62.45,34.07 65.31,34.07 IC5.22 | v31.97,30.1 32.29,30.42 v32.29,51.69
  Bottom 0.152: v62.45,31.53 60.86,29.95 48.32,29.95 48.16,30.1 v31.97,30.1 | v32.29,51.69 31.18,52.81 30.54,52.81 X1.22
IO4_6  (via drill 0.38)
  Top 0.152: v63.4,31.53 63.4,33.76 64.67,33.76 64.99,33.44 65.31,33.44 IC5.23 | v26.73,29.47 27.21,29.95 27.21,42.65 27.53,42.96 v27.53,52.17
  Bottom 0.152: v63.4,31.53 61.5,29.63 48.16,29.63 48.01,29.79 32.61,29.79 32.29,29.47 v26.73,29.47 | v27.53,52.17 27.69,52.33 30.38,52.33 X1.23
IO4_7  (via drill 0.38)
  Top 0.152: v64.36,33.12 64.36,32.8 65.31,32.8 IC5.24 | v69.12,33.12 68.8,32.8 68.8,25.18 69.12,24.87 69.12,24.07 68.64,23.6 68.64,11.05 62.93,5.34 44.67,5.34 44.67,6.13 32.77,18.04 26.42,18.04 26.42,28.2 25.46,29.15 v25.46,41.85 | v26.73,43.12 26.89,43.28 v26.89,51.54
  Bottom 0.152: v69.12,33.12 v64.36,33.12 | v26.73,43.12 v25.46,41.85 | v26.89,51.54 29.43,51.54 29.59,51.69 30.38,51.69 X1.24
LD_/C  (via drill 0.38)
  Top 0.152: v66.58,29.47 IC5.29 | v29.27,28.52 29.27,45.19 29.91,45.82 v29.91,64.55
  Bottom 0.152: 29.91,64.24 31.5,64.24 33.4,62.33 33.4,59.31 30.54,59.31 X1.9 | 29.91,64.24 19.43,64.24 18.64,65.03 R47.1 | v66.58,29.47 65.15,28.04 58.32,28.04 57.37,28.99 37.85,28.99 37.69,29.15 32.92,29.15 32.29,28.52 v29.27,28.52 | 29.91,64.24 v29.91,64.55
LEDK1  (via drill 0.38)
  Top 0.152: v22.61,52.65 25.78,49.47 v25.78,46.93
  Bottom 0.152: v22.61,52.65 22.76,52.65 22.76,53.6 R37.2 | v25.78,46.93 27.37,45.34 30.38,45.34 X1.37
LEDK2  (via drill 0.38)
  Top 0.152: v12.76,41.85 R38.2
  Bottom 0.152: v12.76,41.85 14.51,43.6 23.56,43.6 23.72,43.76 23.72,45.03 29.59,45.03 29.75,44.87 30.38,44.87 X1.38
LEDK3
  Bottom 0.152: R39.2 24.35,44.39 30.38,44.39 X1.39
LEDK4
  Bottom 0.152: R40.2 24.35,41.85 26.26,43.76 30.38,43.76 X1.40
LHVTRIG  (via drill 0.38)
  Top 0.152: v111.51,30.26 112.46,31.22 R13.1 | v68.48,24.55 67.53,25.5 67.53,27.56 66.42,28.68 65.47,28.68 IC5.30
  Bottom 0.152: v111.51,30.26 107.22,25.98 80.71,25.98 79.6,24.87 68.8,24.87 v68.48,24.55
LLED  (via drill 0.38)
  Top 0.152: R44.1 16.89,44.07 16.89,41.69 16.73,41.53 R42.1 16.57,41.53 16.41,41.38 16.41,29.47 17.21,28.68 22.92,28.68 22.92,30.1 | R43.1 22.76,41.53 22.76,39.63 R41.1 22.92,30.1 | v62.45,28.68 64.36,28.68 64.67,28.99 64.67,30.74 65.31,30.74 IC5.27 | 22.92,30.1 v24.19,28.83
  Bottom 0.152: v62.45,28.68 61.82,29.31 48.01,29.31 47.85,29.47 32.77,29.47 32.45,29.15 27.37,29.15 27.05,28.83 v24.19,28.83
LRD  (via drill 0.38)
  Top 0.152: IC5.10 70.71,29.47 v70.71,24.23 | v29.11,25.34 28.48,25.98 v28.48,56.62
  Bottom 0.152: 28.48,59.31 29.43,58.36 30.38,58.36 X1.11 | 28.48,59.31 26.1,61.7 21.02,61.7 18.64,59.31 R50.1 | v70.71,24.23 70.55,24.07 68.96,24.07 68.8,23.91 30.54,23.91 v29.11,25.34 | 28.48,59.31 v28.48,56.62
LRESET  (via drill 0.38)
  Top 0.152: v57.53,24.87 61.82,29.15 61.82,35.82 65.94,35.82 67.21,34.55 67.21,31.53 65.47,31.53 IC5.26 | v30.54,24.87 30.7,25.02 30.7,59.47 v31.65,60.43
  Bottom 0.152: v30.54,24.87 v57.53,24.87 | v31.65,60.43 31.5,60.27 30.54,60.27 X1.7
LTS+
  Top 0.152: R12.2 99.28,12.8 100.08,13.59 100.08,14.39 99.76,14.71 90.55,14.71 90.55,2.96 89.6,2.01 X3.1
  Bottom 0.152: F1.P$4 121.67,9.47 121.67,2.01 89.6,2.01 X3.1
LTS-
  Top 0.152: R12.1 99.12,13.91 94.04,8.83 94.04,5.34 X3.2 94.04,5.18 94.04,2.32 119.76,2.32 122.78,5.34 122.78,18.67 121.82,19.63 F1.P$3
LVSEL  (via drill 0.38)
  Top 0.152: v74.36,31.85 74.36,32.01 73.25,32.01 IC5.14 | v86.11,31.85 87.69,31.85 IC1.11
  Bottom 0.152: v86.11,31.85 v74.36,31.85
LWR  (via drill 0.38)
  Top 0.152: v71.34,26.77 71.34,28.68 73.09,28.68 IC5.9 | v21.34,29.47 18,32.8 v18,51.38
  Bottom 0.152: 17.68,58.52 16.73,58.52 16.57,58.68 16.57,65.82 30.38,65.82 33.72,62.49 33.72,58.84 30.54,58.84 X1.10 | 17.68,58.52 17.84,58.52 17.84,59.79 18.16,60.11 18.48,60.11 18.48,61.22 R49.1 | v71.34,26.77 70.07,25.5 29.91,25.5 29.43,25.98 24.83,25.98 v21.34,29.47 | v18,51.38 18,55.35 17.68,55.66 17.68,58.52
N$1
  Top 0.152: R1.1 95.79,49.15 95.47,48.84 95.47,42.33 94.52,41.38 94.52,36.45 93.73,35.66 93.73,24.23 96.27,21.69 97.69,21.69 IC1.2
N$2  (via drill 0.38)
  Top 0.152: v101.98,32.17 101.98,34.87 102.3,35.18 R2.1 | v96.27,26.61 96.42,26.45 96.42,26.29 97.22,25.5 97.69,25.5 IC1.5
  Bottom 0.152: v101.98,32.17 96.42,26.61 v96.27,26.61
N$3
  Top 0.152: R3.1 95.95,35.18 96.27,34.87 96.27,34.55 98.49,32.33 100.08,32.33 100.08,20.26 99.44,19.63 96.42,19.63 96.42,20.74 96.58,20.9 99.12,20.9 99.12,25.82 98.33,26.61 97.85,26.61 IC1.6
N$4
  Top 0.152: R4.1 95.79,37.72 95.31,37.25 95.31,32.49 97.22,30.58 97.69,30.58 IC1.9
N$5  (via drill 0.38)
  Top 0.152: v111.19,35.98 111.19,39.15 112.3,40.26 R5.1 | v89.6,34.71 89.12,34.23 89.12,31.37 88.33,30.58 87.85,30.58 IC1.12
  Bottom 0.152: v111.19,35.98 109.92,34.71 v89.6,34.71
N$6
  Top 0.152: 106.9,60.58 108.01,59.47 L3.2 | 106.9,60.58 106.58,60.9 106.58,65.66 97.22,65.66 96.9,65.35 96.9,60.11 95.95,59.16 T8.1 | 106.9,60.58 SG1.-
N$7  (via drill 0.38)
  Top 0.152: v108.01,45.03 108.97,45.03 T4.3 | v100.08,43.76 98.01,41.69 98.01,38.36 97.38,37.72 R4.2
  Bottom 0.152: v108.01,45.03 106.74,43.76 v100.08,43.76
N$8
  Top 0.152: T5.3 114.05,38.84 113.89,38.99 113.89,40.26 R5.2
N$9
  Top 0.152: F1.P$1 102.77,19.79 102.77,24.71 106.9,28.83 D2.A 107.06,28.83 107.06,27.41 117.86,27.41 121.82,31.37 H1.4
N$10  (via drill 0.38)
  Top 0.152: v96.74,52.81 95.63,52.81 T1.1 | v100.39,52.01 100.87,52.49 100.87,52.96 R7.1
  Bottom 0.152: v96.74,52.81 97.54,52.01 v100.39,52.01
N$11
  Top 0.152: T2.1 101.66,42.65 101.66,44.55 100.71,45.5 99.76,45.5 99.76,52.96 101.19,54.39 114.36,54.39 114.36,58.04 118.33,62.01 120.4,62.01 120.4,50.58 121.19,49.79 R8.1
N$12
  Top 0.152: T3.1 121.98,53.12 121.35,52.49 121.35,51.69 R9.1
N$13
  Top 0.152: T1.3 97.54,51.85 97.38,51.69 97.38,49.15 R1.2
N$14
  Top 0.152: T2.3 100.71,40.42 101.35,39.79 101.35,35.5 101.03,35.18 R2.2
N$15  (via drill 0.38)
  Top 0.152: v123.25,46.3 123.25,55.03 123.09,55.19 T3.3 | v98.17,36.93 97.38,36.14 97.38,35.18 R3.2
  Bottom 0.152: v123.25,46.3 116.59,39.63 100.87,39.63 v98.17,36.93
N$16  (via drill 0.38)
  Top 0.152: v108.01,41.53 108.01,42.96 T4.1 | v121.51,45.66 121.35,45.82 121.35,47.25 R10.1
  Bottom 0.152: v108.01,41.53 108.17,41.69 117.54,41.69 v121.51,45.66
N$17  (via drill 0.38)
  Top 0.152: R7.2 102.46,52.96 102.46,50.42 C1.2 v111.66,50.42 | 122.62,49.79 v122.62,50.74 122.62,51.69 R9.2 | 122.62,47.25 122.62,44.71 | 122.62,47.25 122.62,49.79 | 122.62,49.79 R8.2 | 122.62,47.25 R10.2 | 122.62,44.71 122.62,42.33 121.98,41.69 IC7.7 | 122.62,44.71 R11.2
  Bottom 0.152: v111.66,50.42 111.98,50.74 v122.62,50.74
N$18
  Top 0.152: 120.71,36.45 121.35,37.09 121.35,44.71 R11.1 | 120.71,36.45 C6.1 118.81,36.45 117.86,37.41 117.86,40.42 117.38,40.9 114.36,40.9 114.2,41.06 110.55,41.06 | 120.71,36.45 IC7.1 | 110.55,41.06 110.55,44.71 107.54,47.73 100.87,47.73 | 110.55,41.06 110.55,29.95 109.6,28.99 D2.C 109.44,28.99 109.44,29.63 106.58,29.63 101.66,24.71 101.66,10.58 102.62,9.63 F1.P$2 | 100.87,47.73 100.87,46.61 C5.1 | 100.87,47.73 100.87,50.42 C1.1
N$19
  Top 0.152: 6.41,31.37 H2.4 5.94,31.37 | 6.41,31.37 12.6,31.37 14.19,29.79 14.19,29.31 15.14,29.31 D1.A | 6.41,31.37 F2.P$1
N$20  (via drill 0.38)
  Top 0.152: v8.16,35.66 8.16,39.47 8.48,39.79 8.48,45.5 R15.1 | v57.37,23.28 57.21,23.44 57.21,24.23 56.42,25.02 55.94,25.02 IC2.2
  Bottom 0.152: v8.16,35.66 18.32,25.5 28,25.5 30.23,23.28 v57.37,23.28
N$21
  Top 0.152: R13.2 112.46,32.8 114.52,32.8 114.52,33.6 H1.1
N$22
  Top 0.152: T8.3 95,57.09 95.15,57.25 95.15,59.79 95.95,60.58 R14.2
N$24  (via drill 0.38)
  Top 0.152: v17.68,32.17 17.68,45.66 12.92,50.42 R16.1 | v57.69,30.58 57.21,30.1 57.21,29.79 56.42,28.99 55.94,28.99 IC2.5
  Bottom 0.152: v17.68,32.17 19.43,30.42 29.27,30.42 29.59,30.74 57.53,30.74 v57.69,30.58
N$25  (via drill 0.38)
  Top 0.152: v9.59,35.66 9.59,48.68 8.48,49.79 R17.1 | v57.53,31.53 57.21,31.22 57.21,31.06 56.42,30.26 55.94,30.26 IC2.6
  Bottom 0.152: v9.59,35.66 11.81,33.44 28.8,33.44 30.86,31.37 52.13,31.37 52.93,32.17 56.9,32.17 v57.53,31.53
N$26  (via drill 0.38)
  Top 0.152: v18.48,55.82 23.56,50.74 23.56,30.42 25.78,28.2 v25.78,27.88 | v57.85,26.93 57.21,26.29 57.21,25.98 57.05,25.82 54.51,25.82 54.51,33.12 55.31,33.91 55.78,33.91 IC2.9
  Bottom 0.152: v18.48,55.82 18.48,57.57 R18.1 | v25.78,27.88 31.02,27.88 31.97,26.93 v57.85,26.93
N$27  (via drill 0.38)
  Top 0.152: v30.07,33.12 30.23,33.28 30.23,59.47 30.54,59.79 30.54,65.19 12.92,65.19 R19.1 | v43.4,32.01 45.31,33.91 45.78,33.91 IC2.12
  Bottom 0.152: v30.07,33.12 31.34,31.85 43.24,31.85 v43.4,32.01
N$28  (via drill 0.38)
  Top 0.152: v14.83,44.87 15.62,44.07 R44.2
  Bottom 0.152: v14.83,44.87 21.97,44.87 22.45,45.34 23.72,45.34 24.51,46.14 T13.3
N$29  (via drill 0.38)
  Top 0.152: v11.02,45.03 T6.3 | v7.84,44.71 7.21,45.34 7.21,45.5 R15.2
  Bottom 0.152: v11.02,45.03 10.7,44.71 v7.84,44.71
N$30
  Top 0.152: T7.3 13.24,53.92 12.92,53.6 12.92,51.38 12.76,51.22 11.49,51.22 11.49,50.42 R16.2
N$31
  Top 0.152: T9.3 8.32,55.98 6.41,55.98 6.41,53.76 7.68,52.49 7.68,50.9 7.05,50.27 7.05,49.95 R17.2
N$32  (via drill 0.38)
  Top 0.152: v16.1,57.73 13.24,57.73 T10.3
  Bottom 0.152: v16.1,57.73 17.05,57.73 R18.2
N$33
  Top 0.152: T11.3 13.08,62.81 12.92,62.65 12.92,60.43 12.6,60.11 11.49,60.11 11.49,62.01 11.81,62.33 11.81,64.71 11.49,65.03 R19.2
N$35
  Top 0.152: T6.1 11.97,47.88 10.38,47.88 10.38,38.99 R22.1
N$36  (via drill 0.38)
  Top 0.152: v11.33,51.85 12.13,51.85 T7.1 | v8.32,48.84 8.32,47.73 R23.1
  Bottom 0.152: v8.32,48.84 v11.33,51.85
N$37
  Top 0.152: T9.1 6.41,56.93 6.1,56.62 6.1,52.81 6.89,52.01 R24.1
N$38
  Top 0.152: T10.1 12.13,55.66 11.97,55.5 11.97,53.44 11.81,53.28 8.48,53.28 8.48,54.23 R25.1
N$39
  Top 0.152: 14.03,38.99 13.72,38.68 C2.2 | R25.2 7.05,54.23 8,53.28 8,52.33 8.32,52.01 R24.2 8.32,51.85 8,51.54 8,51.38 | 8,51.38 8,50.74 7.68,50.42 7.68,48.36 7.05,47.73 R23.2 7.05,47.57 7.05,46.93 8.32,46.93 9.11,46.14 9.11,39.15 R22.2 8.79,38.99 8.79,35.03 6.57,35.03 6.41,35.18 6.41,37.57 5.14,38.84 5.14,40.9 4.51,41.53 IC8.7 | 14.03,38.99 14.03,47.25 11.65,49.63 9.11,49.63 9.11,50.27 8,51.38 | 14.03,38.99 R26.2
N$40  (via drill 0.38)
  Top 0.152: C8.1 30.23,19.47 29.91,19.79 29.91,22.8 C7.1 29.91,22.96 v29.91,30.1 | v17.05,30.1 17.05,29.95 17.68,29.31 D1.C | v14.67,30.42 11.97,33.12 11.97,34.71 | 11.97,36.45 11.97,34.71 | 11.97,36.45 11.97,38.36 12.6,38.99 R26.1 | 11.97,36.45 C2.1 | 3.87,35.66 3.24,36.3 IC8.1 | 3.87,35.66 3.87,35.18 4.35,34.71 11.97,34.71 | F2.P$2 2.44,13.75 2.44,34.23 3.87,35.66
  Bottom 0.152: v14.67,30.42 16.73,30.42 v17.05,30.1 v29.91,30.1
N$41
  Bottom 0.152: R37.1 23.72,53.6 23.72,52.17 T12.1
N$42  (via drill 0.38)
  Top 0.152: v70.71,20.42 71.5,21.21 R21.2 | v14.19,28.04 13.24,28.99 H2.1
  Bottom 0.152: v70.71,20.42 70.23,19.94 29.43,19.94 24.19,25.18 17.05,25.18 v14.19,28.04
N$43
  Top 0.152: T15.1 11.97,42.8 11.49,43.28 11.49,44.07 R38.1
N$44  (via drill 0.38)
  Top 0.152: v20.22,44.23 20.22,45.34 T14.1
  Bottom 0.152: v20.22,44.23 22.92,44.23 R39.1
N$45
  Top 0.152: IC7.4 124.52,35.03 118.33,35.03 117.54,35.82 117.54,40.26 115.32,40.26 115,39.95 115,36.77 113.25,36.77 T5.1
N$46
  Bottom 0.152: T13.1 23.56,48.2 22.29,46.93 22.13,46.93 21.34,46.14 13.56,46.14 12.13,44.71 12.13,41.22 22.45,41.22 22.92,41.69 R40.1
N$47
  Top 0.152: IC8.4 7.05,37.41 6.41,38.04 6.41,42.8 5.62,43.6 5.62,59.31 9.59,59.47 9.59,65.98 11.81,65.98 12.13,65.66 12.13,60.9 T11.1
N$48
  Top 0.152: T14.3 19.11,43.28 19.11,41.53 R43.2
N$49  (via drill 0.38)
  Top 0.152: v24.51,48.2 24.35,48.04 24.35,39.63 R41.2
  Bottom 0.152: v24.51,48.2 24.51,49.95 T12.3
N$50
  Top 0.152: T15.3 11.02,40.58 12.29,40.58 12.29,40.11 12.6,39.79 13.4,39.79 13.4,37.88 12.76,37.25 12.76,35.66 13.08,35.34 15.3,35.34 15.3,41.53 R42.2
RHVTRIG
  Top 0.152: R21.1 72.77,21.37 72.29,21.85 72.29,24.55 72.61,24.87 73.09,24.87 IC5.3
RTS+
  Top 0.152: F2.P$4 25.46,12.64 29.11,12.64 R27.2 29.27,12.64 34.04,7.88 34.04,7.09 39.12,2.01 X5.1
RTS-
  Top 0.152: F2.P$3 25.46,17.72 29.11,14.07 R27.1 29.27,13.91 35.15,13.91 43.72,5.34 X5.2
RVSEL  (via drill 0.38)
  Top 0.152: v64.36,31.85 64.36,32.01 65.31,32.01 IC5.25 | v49.12,32.49 46.42,35.18 45.94,35.18 IC2.11
  Bottom 0.152: v64.36,31.85 64.04,32.17 59.44,32.17 58.8,32.8 49.43,32.8 v49.12,32.49
SCL  (via drill 0.38)
  Top 0.152: v74.83,28.99 74.83,30.9 74.36,30.9 73.88,31.37 73.25,31.37 IC5.13 | v78.33,25.82 77.37,24.87 77.37,24.07 77.69,23.75 78.96,23.75 78.96,11.53 77.53,10.1 77.53,8.83 X2.2 77.37,8.67 77.37,7.24 v75.79,5.66 | v49.59,6.61 49.59,8.51 49.43,8.67 X4.2
  Bottom 0.152: v74.83,28.99 79.12,28.99 80.07,28.04 80.07,25.82 v78.33,25.82 | v49.59,6.61 50.55,5.66 v75.79,5.66
SDA  (via drill 0.38)
  Top 0.152: IC5.12 73.09,30.74 70.07,30.74 70.07,14.39 71.5,12.96 v71.5,8.51 74.99,5.02 78.17,5.02 78.17,8.67 X2.3 | v62.77,6.29 62.77,5.66 51.82,5.66 50.55,6.93 50.55,8.36 50.23,8.67 X4.3
  Bottom 0.152: v62.77,6.29 64.99,8.51 v71.5,8.51
SPKR  (via drill 0.38)
  Top 0.152: v93.88,37.88 93.88,41.22 95.15,42.49 95.15,51.54 94.84,51.85 94.84,53.44 95.15,53.76 95.15,55.35 94.2,56.3 94.2,60.27 94.52,60.58 R14.1 | v83.57,30.26 v90.23,36.93 | v74.2,30.26 73.25,30.26 IC5.11
  Bottom 0.152: v93.88,37.88 92.93,36.93 v90.23,36.93 | v74.2,30.26 v83.57,30.26
TCK  (via drill 0.38)
  Top 0.152: SV1.3 66.9,12.8 66.9,25.5 65.47,25.5 IC5.35 | v93.09,36.3 90.07,33.28 v90.07,20.26
  Bottom 0.152: v93.09,36.3 104.36,36.3 105.63,37.57 S5.4 | v90.07,20.26 85.79,15.98 71.18,15.98 67.53,12.32 SV1.3
TDI
  Top 0.152: IC5.37 65.31,24.23 64.36,24.23 64.36,14.39 62.45,12.48 62.45,12.32 SV1.5
  Bottom 0.152: SV1.5 60.55,14.07 49.43,14.07 46.58,16.93 S7.4
TDO
  Top 0.152: IC5.38 65.31,23.6 64.67,22.96 64.67,14.23 63.56,13.12 63.56,11.05 62.93,10.42 59.91,10.42 59.91,12.17 SV1.6
TEST
  Top 0.152: IC5.1 73.25,23.6 73.56,23.28 73.56,13.28 72.61,12.32 SV1.1
TMS  (via drill 0.38)
  Top 0.152: IC5.36 65.47,24.87 66.26,24.87 66.26,13.59 64.99,12.32 SV1.4 | v31.34,35.18 31.02,34.87 31.02,25.34 31.18,25.18 31.18,18.52 31.34,18.36 v34.67,18.36
  Bottom 0.152: v31.34,35.18 19.27,35.18 16.26,38.2 S6.4 | v34.67,18.36 58.8,18.36 SV1.4
VBAT  (via drill 0.38)
  Top 0.152: R45.1 95.95,41.53 96.58,40.9 v96.58,38.68 96.58,34.71 98.01,33.28 101.66,33.28 101.66,41.38 102.3,42.01 102.3,44.07 R46.2 | v68.48,37.25 68.48,30.26 65.47,30.26 IC5.28
  Bottom 0.152: v68.48,37.25 68.64,37.41 89.76,37.41 90.87,38.52 96.42,38.52 v96.58,38.68
VCC  (via drill 0.38)
  Top 0.305: v47.85,8.83 48.48,8.83 X4.1 | X2.1 76.58,8.83 v75.95,9.47 76.1,9.47 76.1,32.8 v81.34,38.04 | 108.01,62.01 L3.1 108.01,61.85 | 108.01,62.01 108.01,66.14 97.06,66.14 95.31,64.39 C10.1 | SG1.+ 118.81,60.58 118.81,45.19 117.38,43.76 IC3.3 117.22,43.6 v117.22,42.33 | v117.38,62.01 108.01,62.01
  Bottom 0.305: v47.85,8.83 48.48,9.47 v75.95,9.47 | v117.38,62.01 118.81,60.58 SG1.+ | v81.34,38.04 82.3,38.99 95,38.99 98.33,42.33 v117.22,42.33
XIN  (via drill 0.38)
  Top 0.152: v71.98,28.04 71.98,26.93 73.09,26.93 IC5.6 | v76.9,28.36 78.17,28.36 Q3.2 78.17,30.42 C12.1
  Bottom 0.152: v71.98,28.04 72.29,28.36 v76.9,28.36
XOUT  (via drill 0.38)
  Top 0.152: v74.2,26.77 74.2,26.29 73.25,26.29 IC5.5 | v76.9,26.77 78.17,26.77 Q3.1 78.17,26.61 C11.1
  Bottom 0.152: v76.9,26.77 v74.2,26.77